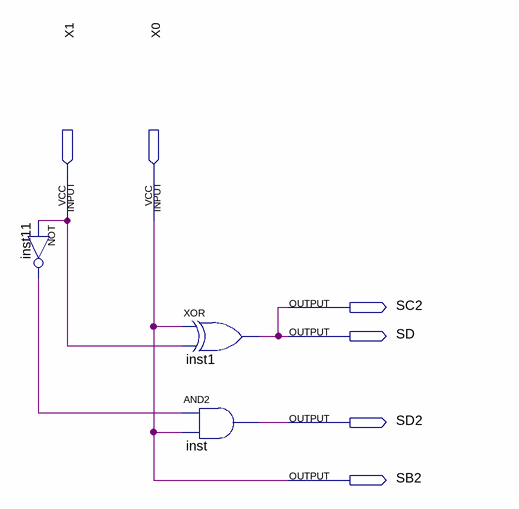
[diagram p0: schematic sheet]
// Quartus schematic Decodificador2x8Soma.bdf as structural Verilog: 3 symbols, 6 pins
module Decodificador2x8Soma (
  input  X1,
  input  X0,
  output SC2,
  output SD,
  output SD2,
  output SB2
);

  wire inst11_out;

  not inst11 (inst11_out, X1);
  xor inst1 (SC2, X0, X1);
  and inst (SD2, inst11_out, X0);

  assign SB2 = X0;
  assign SD = SC2;
endmodule
